# Altium schematic sheet Experiment 3.SchDoc
size A4; Organization: Altium Limited; Address1: L3, 12a Rodborough Rd; Address2: Frenchs Forest; Address3: NSW; Address4: Australia 2086; DocumentNumber: 3; SheetNumber: 3; SheetTotal: 3
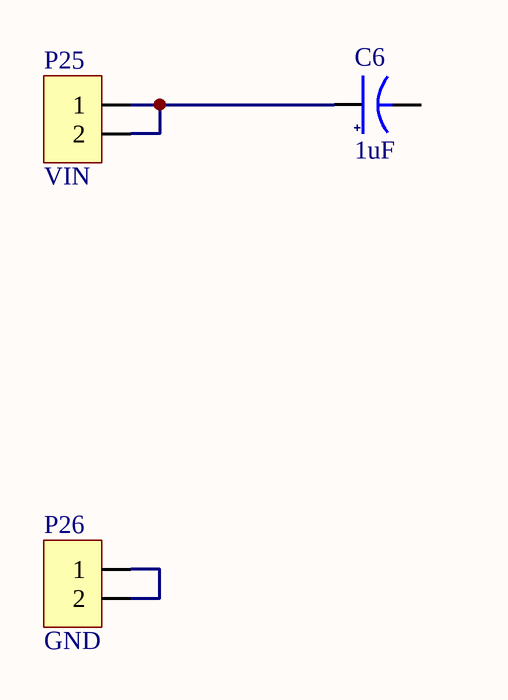
[diagram p0: Experiment 3.SchDoc]

## Parts
C6  1uF  [C0805]
P25  VIN  [PINHD-1X02 ONCE]
P26  GND  [PINHD-1X02 ONCE]

## Nets
NetC6_1: C6.1 P25.1 P25.2
NetP26_1: P26.1 P26.2

Not connected (* = marked no-connect by the designer): C6 2

## Notes on the sheet
- Elivelton Santos
- https://github.com/eliveltonpsantos
- Project:
- Sheet:
- Date:
- Time:
- Sheet
- of
- File:

## Library data of the parts
C6 = CC0805ZKY5V9BB105: CAP CER 1UF 50V Y5V 0805; Manufacturer: Yageo; Tolerance: ±20%; Category: Capacitors; Manufacturer Part Number: CC0805ZKY5V9BB105; Package / Case: 0805 (2012 Metric); Capacitance: 1uF; Voltage: 50V; Supplier 1: Digi-Key; Supplier Part Number 1: 311-1909-1-ND
P25 P26 = PIN HEADER 1X02 ONCE: CONN HEADER 2POS .100" STR TIN; Manufacturer: Molex, LLC; Manufacturer Part Number: 0901200122; Category: Connectors; Supplier 1: Digi-Key; Supplier Part Number 1: WM8072-ND